# EAGLE design LM4702Driver (EAGLE 5.07)
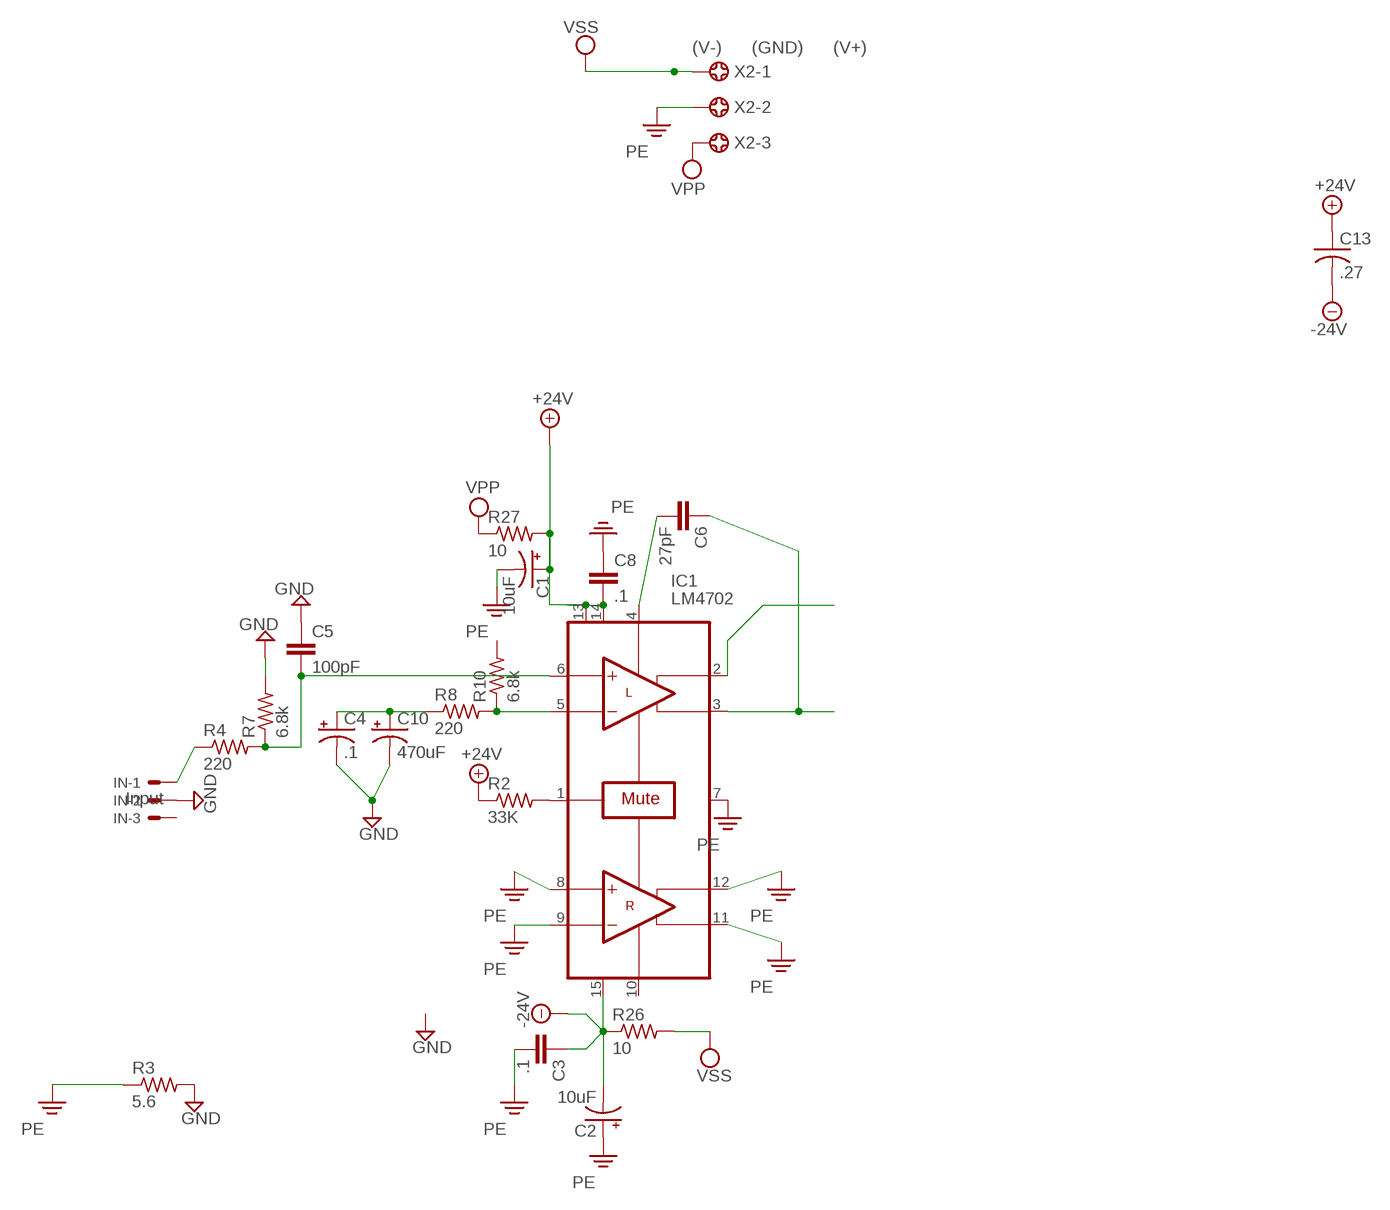
[diagram p0: schematic, sheet 1]

## Parts
C1  10uF  CPOL-USTT2D5  [TT2D5]
C2  10uF  CPOL-USTT2D5  [TT2D5]
C3  .1  C-EU025-025X050  [C025-025X050]
C4  .1  CPOL-USB45181B  [B45181B]
C5  100pF  C-EU025-030X050  [C025-030X050]
C6  27pF  C-EU050-030X075  [C050-030X075]
C8  .1  C-EU025-025X050  [C025-025X050]
C10  470uF  CPOL-USE3.5-8  [E3,5-8]
C13  .27  C-US102-064X133  [C102-064X133]
IC1  LM4702  [SIP15]
IN  Input  22-23-2031  [22-23-2031]
R2  33K  R-US_0204/5  [0204/5]
R3  5.6  R-US_0207/10  [0207/10]
R4  220  R-US_0204/5  [0204/5]
R7  6.8k  R-US_0204/5  [0204/5]
R8  220  R-US_0204/7  [0204/7]
R10  6.8k  R-US_0204/7  [0204/7]
R26  10  R-US_0207/7  [0207/7]
R27  10  R-US_0207/7  [0207/7]
X2  (V-) (GND) (V+)  5202-03-N-02  [5202-03-N-02]

## Nets
+24V: C1.+ C8.2 C13.1 IC1.13(VCC) IC1.14(VCC) R2.1 R27.2
-24V: C2.- C3.1 C13.2 IC1.15(VEE) R26.1
GND: C4.- C5.1 C10.- IN.2 R3.2 R7.2
N$1: IN.1 R4.1
N$2: IC1.1(MUTE) R2.2
N$6: C4.+ C10.+ R8.1
N$7: C6.2 IC1.4(COMP1)
N$10: C6.1 IC1.3(SINK1)
N$13: IC1.5(-IN1) R8.2 R10.1
N$16: C5.2 IC1.6(+IN1) R4.2 R7.1
N$30: IC1.2(SOURCE1)
PE: C1.- C2.+ C3.2 C8.1 IC1.7(GND) IC1.8(+IN2) IC1.9(-IN2) IC1.11(SINK2) IC1.12(SOURCE2) R3.1 X2.2
VPP: R27.1 X2.3
VSS: R26.2 X2.1
Unconnected: IC1.10(COMP2) IN.3 R10.2

## Library data of the parts
C1 C2 = rcl:CPOL-US: POLARIZED CAPACITOR, American symbol
C3 C8 = rcl:C-EU: CAPACITOR, European symbol
C4 C10 = resistor:CPOL-US: POLARIZED CAPACITOR, American symbol
C5 C6 = resistor:C-EU: CAPACITOR, European symbol
C13 = resistor:C-US: CAPACITOR, American symbol
IC1 = LM4702:LM4702: LM4702 Overture® Audio Power Amplifier Series Stereo High Fidelity 200 Volt* Driver with Mute
IN = con-molex:22-23-2031: .100" (2.54mm) Center Header - 3 Pin
R2-R4 R7 R8 R10 R26 R27 = resistor:R-US_: RESISTOR, American symbol
X2 = con-ebyelectro:5202-03-N-02: Barrier Blocks Sreies 5202 Source: http://www.ebyelectro.com/PDF/5202-XX-N-02.pdf

## Board
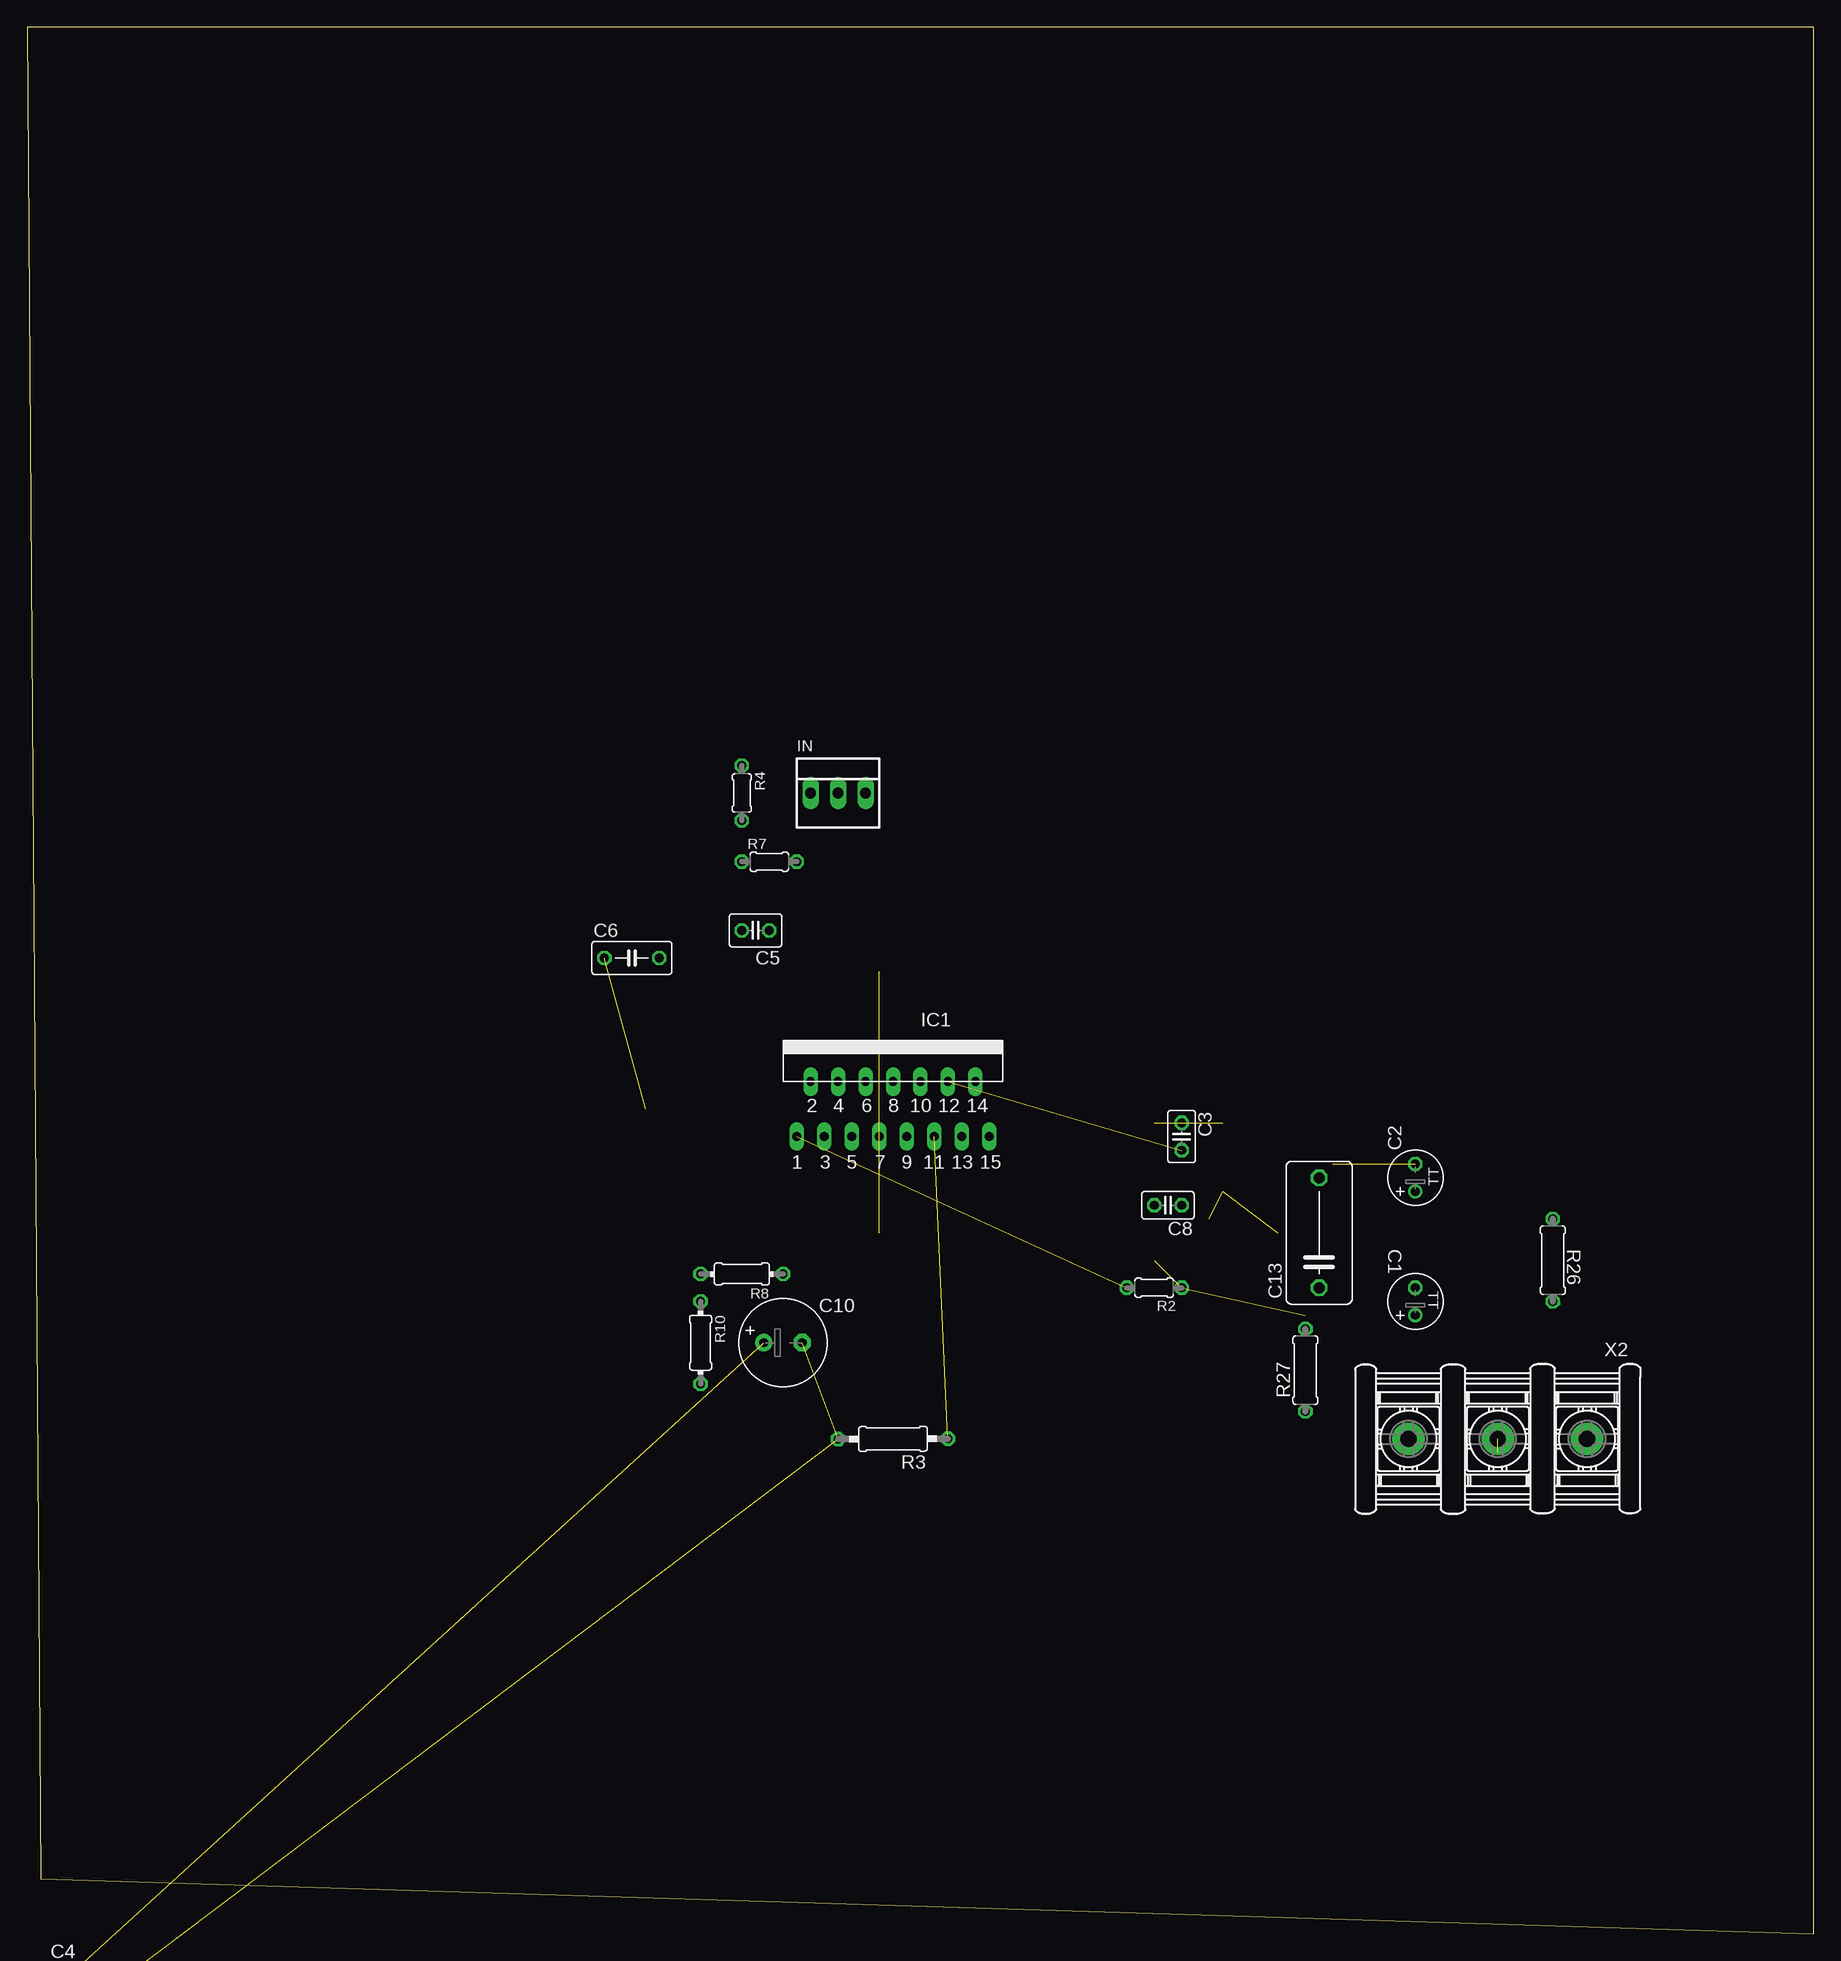
[diagram p1: board, top side]
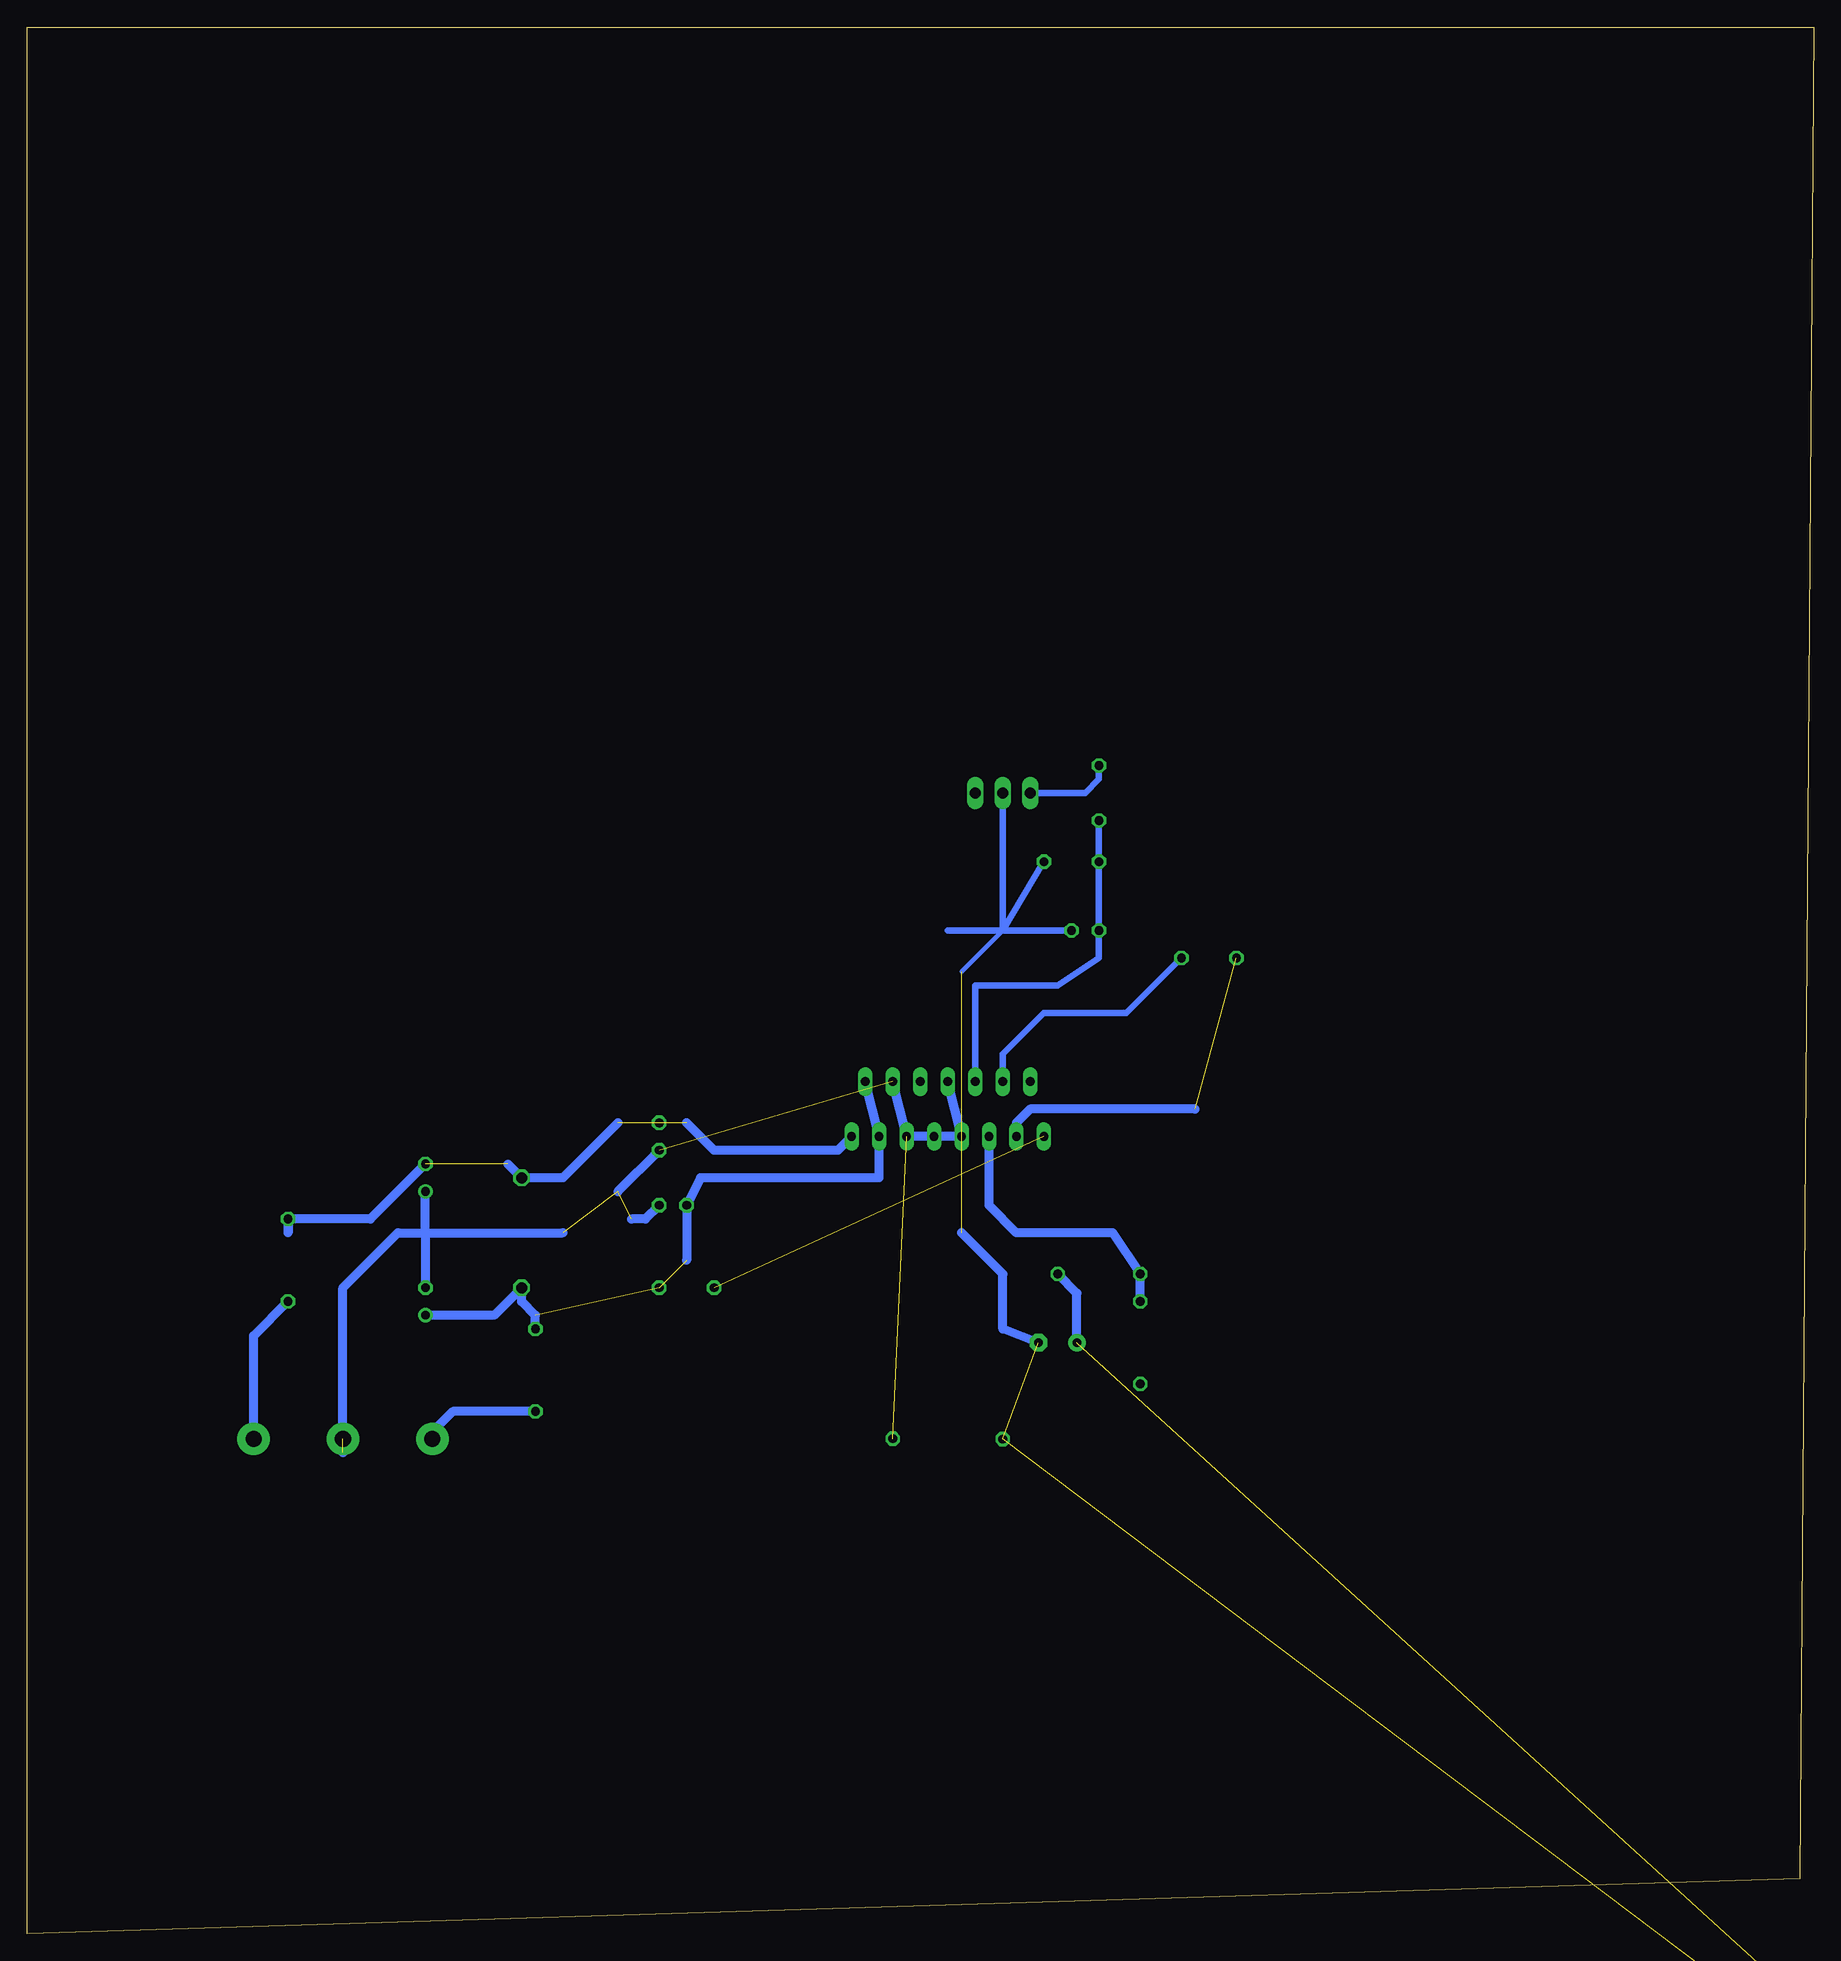
[diagram p2: board, bottom side, seen from below]

Size 165.08 x 176.2 mm. Coordinates in mm from the lower left corner, seen from the top.
Outline: 1.27,5.08 165.08,0 165.08,176.2 0,176.2 1.27,5.08
Copper layers (1*16): Top 0.035mm / dielectric 1.5mm / Bottom 0.035mm
Design rules "default *": minimum track width 24mil, minimum drill 24mil, track to track 8mil, track to pad 8mil, pad to pad 8mil, via to via 8mil, smd to smd 8mil, copper to edge 40mil, drill to drill 8mil, minimum pad ring 10mil, minimum via ring 8mil, stop-mask expansion 4mil, vias tented up to drill 0mil, thermal gap 10mil

### Footprints (pad centres in the part's own frame; a part is rotated, then mirrored left to right if it is on the bottom)
TT2D5 = drill 0.813 round: + -1.27,0 | drill 0.813 octagon: - 1.27,0
C025-025X050 = drill 0.813 octagon: 1 -1.27,0; 2 1.27,0
B45181B = drill 0.813 round: + -2.54,0 | drill 0.813 octagon: - 2.54,0
C025-030X050 = drill 0.813 octagon: 1 -1.27,0; 2 1.27,0
C050-030X075 = drill 0.813 octagon: 1 -2.54,0; 2 2.54,0
E3,5-8 = drill 0.813 pad 1.6 round: + -1.778,0 | drill 0.813 pad 1.6 octagon: - 1.778,0
C102-064X133 = drill 1.016 octagon: 1 -5.08,0; 2 5.08,0
SIP15 = drill 0.813 pad 1.321 long: 1 -8.89,-2.54; 2 -7.62,2.54; 3 -6.35,-2.54; 4 -5.08,2.54; 5 -3.81,-2.54; 6 -2.54,2.54; 7 -1.27,-2.54; 8 0,2.54; 9 1.27,-2.54; 10 2.54,2.54; 11 3.81,-2.54; 12 5.08,2.54; 13 6.35,-2.54; 14 7.62,2.54; 15 8.89,-2.54
22-23-2031 = drill 1 long: 1 -2.54,0; 2 0,0; 3 2.54,0
0204/5 = drill 0.813 octagon: 1 -2.54,0; 2 2.54,0
0207/10 = drill 0.813 octagon: 1 -5.08,0; 2 5.08,0
0204/7 = drill 0.813 octagon: 1 -3.81,0; 2 3.81,0
0207/7 = drill 0.813 octagon: 1 -3.81,0; 2 3.81,0
5202-03-N-02 = drill 1.5 pad 3 round: 1 -8.25,0; 2 0,0; 3 8.25,0

### Placement (x,y rotation side)
C1  128.27,58.42 90.1 top
C2  128.27,69.85 90 top
C3  106.68,73.66 270 top
C4  5.08,-5.08 0 top  (outside the outline)
C5  67.31,92.71 180 top
C6  55.88,90.17 0 top
C8  105.41,67.31 180 top
C10  69.85,54.61 0 top
C13  119.38,64.77 90 top
IC1  80.01,76.2 0 top
IN  74.93,105.41 0 top
R2  104.14,59.69 180 top
R3  80.01,45.72 180.2 top
R4  66.04,105.41 270 top
R7  68.58,99.06 0 top
R8  66.04,60.96 180 top
R10  62.23,54.61 270 top
R26  140.97,62.23 270.1 top
R27  118.11,52.07 90 top
X2  135.89,45.72 180 top

### Tracks (layer width: path | path; a pad name or v marks a point on that pad's centre or on a via)
+24V  (2 unrouted)
  Bottom 0.813: IC1.14 IC1.13 86.36,69.85 102.87,69.85 C8.2 104.14,62.23 | R27.2 118.11,57.15 119.38,58.42 C13.1 121.92,57.15 C1.+
-24V  (3 unrouted)
  Bottom 0.813: 110.49,74.93 115.57,69.85 C13.2 120.65,71.12 | C2.- 133.35,66.04 R26.1 140.97,64.77 140.96,64.78 R26.1 | IC1.15 90.17,72.39 101.6,72.39 104.14,74.93
GND  (3 unrouted)
  Bottom 0.406: 74.93,92.71 78.74,88.9
  Bottom 0.61: C5.1 74.93,92.71 | 74.93,92.71 80.02,92.71 | 74.93,92.71 R7.2 | 74.93,92.71 IN.2
  Bottom 0.813: C10.- 74.93,55.88 74.93,60.96 78.74,64.77
N$1
  Bottom 0.61: R4.1 66.04,106.68 67.31,105.41 IN.1
N$2  (1 unrouted)
N$6  (1 unrouted)
  Bottom 0.813: R8.1 68.07,59.18 C10.+
N$7
  Bottom 0.61: C6.2 63.5,85.09 71.12,85.09 74.93,81.28 IC1.4
N$10  (1 unrouted)
  Bottom 0.813: IC1.3 73.66,74.93 72.39,76.2 57.15,76.2
N$13
  Bottom 0.813: IC1.5 76.2,67.31 73.66,64.77 64.77,64.77 R8.2 R10.1
N$16
  Bottom 0.61: R4.2 R7.1 C5.2 66.04,90.17 69.85,87.63 77.47,87.63 IC1.6
PE  (5 unrouted)
  Bottom 0.813: C3.2 110.49,68.58 | C8.1 107.95,66.04 109.22,66.04 | 128.27,64.77 115.57,64.77 | 128.27,64.77 130.81,64.77 135.89,59.69 135.89,44.45 | 128.27,64.77 C2.+ | C1.- 128.27,64.77 | IC1.8 IC1.7 IC1.9 IC1.11 IC1.12
VPP
  Bottom 0.813: R27.1 125.73,48.26 127.64,46.35 X2.3
VSS
  Bottom 0.813: R26.2 144.14,55.26 X2.1